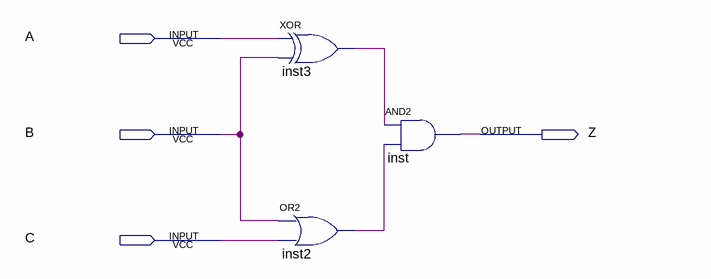
[diagram p0: schematic sheet]
// Quartus schematic lab1.bdf as structural Verilog: 3 symbols, 4 pins
module lab1 (
  input  A,
  input  B,
  input  C,
  output Z
);

  wire inst2_out, inst3_out;

  xor inst3 (inst3_out, A, B);
  or inst2 (inst2_out, B, C);
  and inst (Z, inst3_out, inst2_out);
endmodule
